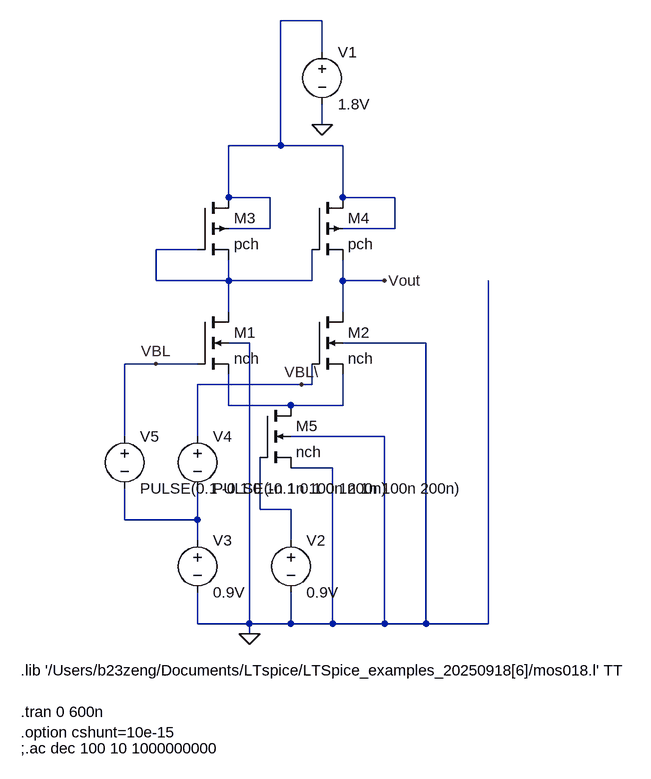
[diagram p0: schematic senseamp_v1.asc]
senseamp_v1.asc, the LTspice schematic file:
Version 4
SHEET 1 1164 1104
WIRE 464 -32 400 -32
WIRE 464 16 464 -32
WIRE 464 128 464 96
WIRE 400 160 400 -32
WIRE 400 160 320 160
WIRE 496 160 400 160
WIRE 320 240 320 160
WIRE 384 240 320 240
WIRE 496 240 496 160
WIRE 576 240 496 240
WIRE 384 288 384 240
WIRE 384 288 320 288
WIRE 576 288 576 240
WIRE 576 288 496 288
WIRE 272 320 208 320
WIRE 208 368 208 320
WIRE 320 368 320 336
WIRE 320 368 208 368
WIRE 448 368 448 320
WIRE 448 368 320 368
WIRE 496 368 496 336
WIRE 560 368 496 368
WIRE 320 416 320 368
WIRE 496 416 496 368
WIRE 352 464 320 464
WIRE 624 464 496 464
WIRE 208 496 160 496
WIRE 272 496 208 496
WIRE 432 528 272 528
WIRE 448 528 448 496
WIRE 448 528 432 528
WIRE 320 560 320 512
WIRE 416 560 320 560
WIRE 496 560 496 512
WIRE 496 560 416 560
WIRE 160 608 160 496
WIRE 272 608 272 528
WIRE 560 608 416 608
WIRE 480 656 416 656
WIRE 368 720 368 640
WIRE 416 720 368 720
WIRE 160 736 160 688
WIRE 272 736 272 688
WIRE 272 736 160 736
WIRE 272 768 272 736
WIRE 416 768 416 720
WIRE 272 896 272 848
WIRE 352 896 352 464
WIRE 352 896 272 896
WIRE 416 896 416 848
WIRE 416 896 352 896
WIRE 480 896 480 656
WIRE 480 896 416 896
WIRE 560 896 560 608
WIRE 560 896 480 896
WIRE 624 896 624 464
WIRE 624 896 560 896
WIRE 720 896 720 368
WIRE 720 896 624 896
WIRE 352 912 352 896
FLAG 464 128 0
FLAG 560 368 Vout
FLAG 352 912 0
FLAG 208 496 VBL
FLAG 432 528 VBL\
SYMBOL Voltage 464 0 R0
SYMATTR InstName V1
SYMATTR Value 1.8V
SYMBOL pmos4 272 240 R0
SYMATTR InstName M3
SYMATTR Value pch
SYMATTR Value2 l=0.72e-6 w=0.5e-6
SYMBOL pmos4 448 240 R0
SYMATTR InstName M4
SYMATTR Value pch
SYMATTR Value2 l=0.72e-6 w=0.5e-6
SYMBOL Voltage 416 752 R0
SYMATTR InstName V2
SYMATTR Value 0.9V
SYMBOL nmos4 272 416 R0
SYMATTR InstName M1
SYMATTR Value nch
SYMATTR Value2 l=0.18e-6 w=0.5e-6
SYMBOL nmos4 368 560 R0
SYMATTR InstName M5
SYMATTR Value nch
SYMATTR Value2 l=0.72e-6 w=0.5e-6
SYMBOL nmos4 448 416 R0
SYMATTR InstName M2
SYMATTR Value nch
SYMATTR Value2 l=0.18e-6 w=0.5e-6
SYMBOL voltage 272 752 R0
SYMATTR InstName V3
SYMATTR Value 0.9V
SYMBOL voltage 272 592 R0
SYMATTR InstName V4
SYMATTR Value PULSE(-0.1 0.1 0 1n 1n 100n 200n)
SYMATTR Value2 AC 1
SYMBOL voltage 160 592 R0
SYMATTR InstName V5
SYMATTR Value PULSE(0.1 -0.1 0 1n 1n 100n 200n)
TEXT 0 1032 Left 2 !.tran 0 600n\n.option cshunt=10e-15
TEXT 0 968 Left 2 !.lib '/Users/b23zeng/Documents/LTspice/LTSpice_examples_20250918[6]/mos018.l' TT
TEXT 0 1088 Left 2 !;.ac dec 100 10 1000000000

The netlist it stands for:
* senseamp_v1.asc
V1 N001 0 1.8V
M3 N001 N002 N002 N001 pch l=0.72e-6 w=0.5e-6
M4 N001 N002 Vout N001 pch l=0.72e-6 w=0.5e-6
V2 N004 0 0.9V
M1 N002 VBL N003 0 nch l=0.18e-6 w=0.5e-6
M5 N003 N004 0 0 nch l=0.72e-6 w=0.5e-6
M2 Vout VBL\ N003 0 nch l=0.18e-6 w=0.5e-6
V3 N005 0 0.9V
V4 VBL\ N005 PULSE(-0.1 0.1 0 1n 1n 100n 200n) AC 1
V5 VBL N005 PULSE(0.1 -0.1 0 1n 1n 100n 200n)
.model NMOS NMOS
.model PMOS PMOS
.lib standard.mos
.tran 0 600n
.option cshunt=10e-15
.lib '/Users/b23zeng/Documents/LTspice/LTSpice_examples_20250918[6]/mos018.l' TT
;.ac dec 100 10 1000000000
.backanno
.end